# Altium schematic sheet microd-header-adapter-board-rev2.SchDoc
size A; SheetNumber: 1; SheetTotal: 1
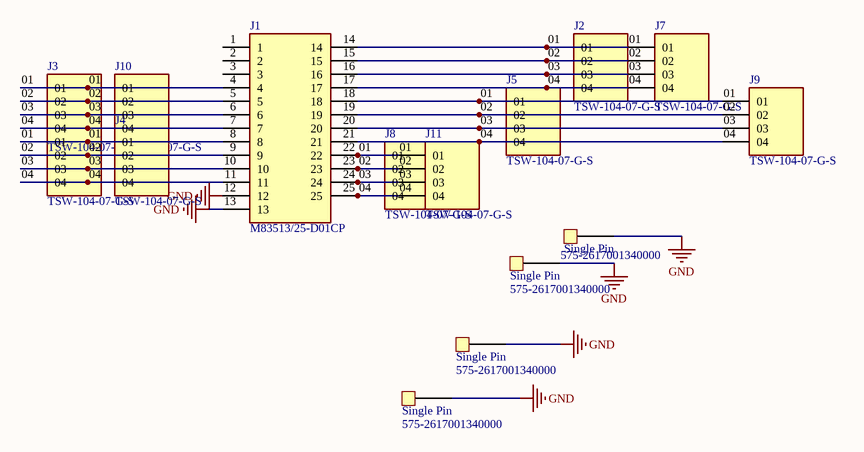
[diagram p0: microd-header-adapter-board-rev2.SchDoc]

## Parts
J1  M83513/25-D01CP  [BEL_M83513/25-D01CP]
J2  TSW-104-07-G-S  [SAMTEC_TSW-104-07-G-S]
J3  TSW-104-07-G-S  [SAMTEC_TSW-104-07-G-S]
J4  TSW-104-07-G-S  [SAMTEC_TSW-104-07-G-S]
J5  TSW-104-07-G-S  [SAMTEC_TSW-104-07-G-S]
J6  TSW-104-07-G-S  [SAMTEC_TSW-104-07-G-S]
J7  TSW-104-07-G-S  [SAMTEC_TSW-104-07-G-S]
J8  TSW-104-07-G-S  [SAMTEC_TSW-104-07-G-S]
J9  TSW-104-07-G-S  [SAMTEC_TSW-104-07-G-S]
J10  TSW-104-07-G-S  [SAMTEC_TSW-104-07-G-S]
J11  TSW-104-07-G-S  [SAMTEC_TSW-104-07-G-S]
J12  Single Pin  Supplier Part Number 1: 575-2617001340000  [Single PC Pin]
J13  Single Pin  Supplier Part Number 1: 575-2617001340000  [Single PC Pin]
J14  Single Pin  Supplier Part Number 1: 575-2617001340000  [Single PC Pin]
J15  Single Pin  Supplier Part Number 1: 575-2617001340000  [Single PC Pin]

## Nets
GND: J1.12 J1.13 J12.1 J13.1 J14.1 J15.1
NetJ1_4: J1.4 J3.01 J10.01
NetJ1_5: J1.5 J3.02 J10.02
NetJ1_6: J1.6 J3.03 J10.03
NetJ1_7: J1.7 J3.04 J10.04
NetJ1_8: J1.8 J4.01 J6.01
NetJ1_9: J1.9 J4.02 J6.02
NetJ1_10: J1.10 J4.03 J6.03
NetJ1_11: J1.11 J4.04 J6.04
NetJ1_14: J1.14 J2.01 J7.01
NetJ1_15: J1.15 J2.02 J7.02
NetJ1_16: J1.16 J2.03 J7.03
NetJ1_17: J1.17 J2.04 J7.04
NetJ1_18: J1.18 J5.01 J9.01
NetJ1_19: J1.19 J5.02 J9.02
NetJ1_20: J1.20 J5.03 J9.03
NetJ1_21: J1.21 J5.04 J9.04
NetJ1_22: J1.22 J8.01 J11.01
NetJ1_23: J1.23 J8.02 J11.02
NetJ1_24: J1.24 J8.03 J11.03
NetJ1_25: J1.25 J8.04 J11.04

Not connected (* = marked no-connect by the designer): J1 1 2 3

## Library data of the parts
J1 = M83513/25-D01CP: MIL-DTL-83513 PCB Mounted Connector | Socket | 25 Positions | Shell Finish - Cadmium | Female | PCB Solder Pins | 0.109" (2.77 mm) Pin Length; Package: None; Price: None; Value: *; MP: M83513/25-D01CP; Availability: Unavailable
J2-J11 = TSW-104-07-G-S: <a href="https://pricing.snapeda.com/parts/TSW-104-07-G-S/Samtec/view-part?ref=eda">Check availability</a>; MP: altium_native_batch; Package: None; Price: None; Value: *; Availability: Unavailable
J12-J15 = Single PC Pin: Supplier 1: Mouser